# Altium schematic sheet Analog Mux.SchDoc: Analog Mux
size D; DrawnBy: C. Lewis; Engineer: C. Lewis; Address1: 4650 NORRIS CANYON RD.; Address2: SAN RAMON, CA 94583; DocumentNumber: 35133; Revision: D; SheetNumber: 9; SheetTotal: 20; ProjectName: HYDRA
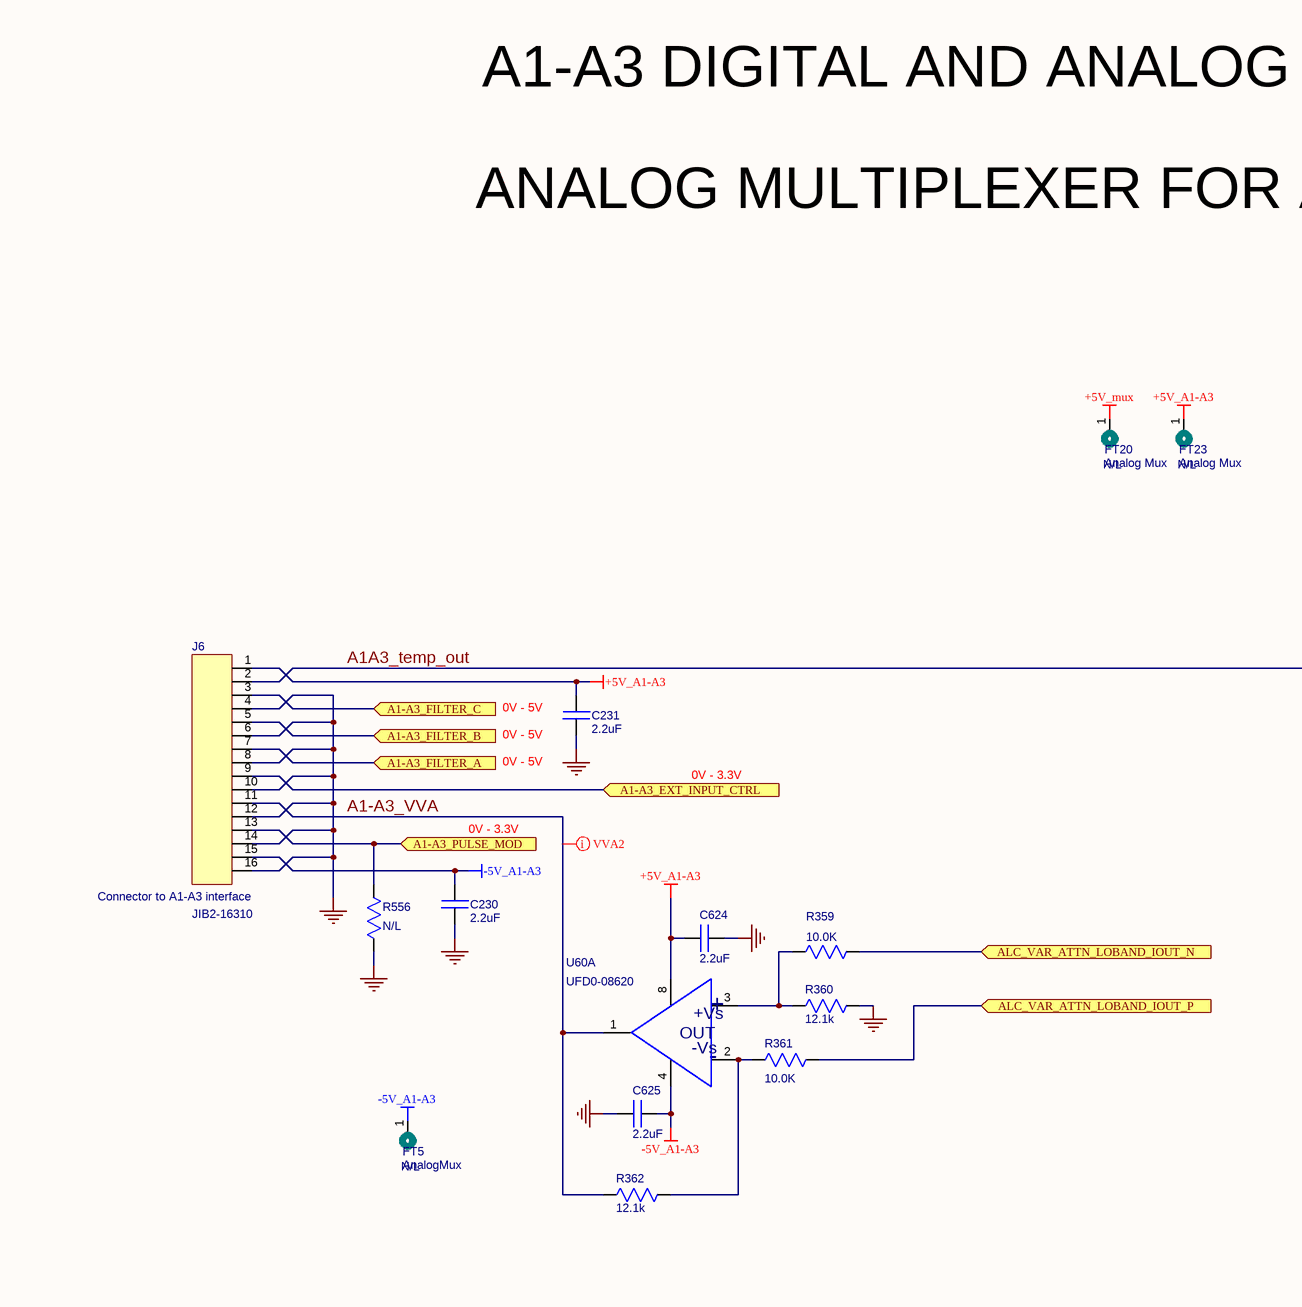
[diagram p0: Analog Mux.SchDoc, top left]
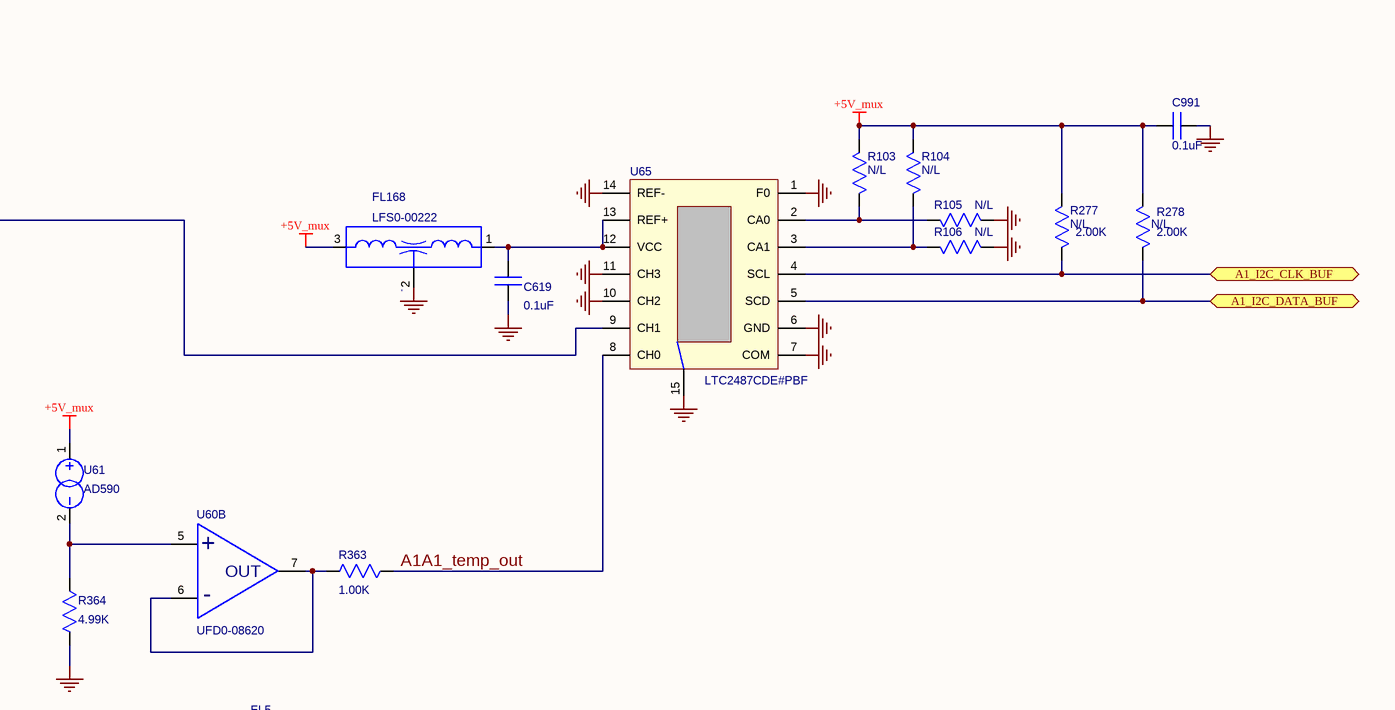
[diagram p1: Analog Mux.SchDoc, top right]
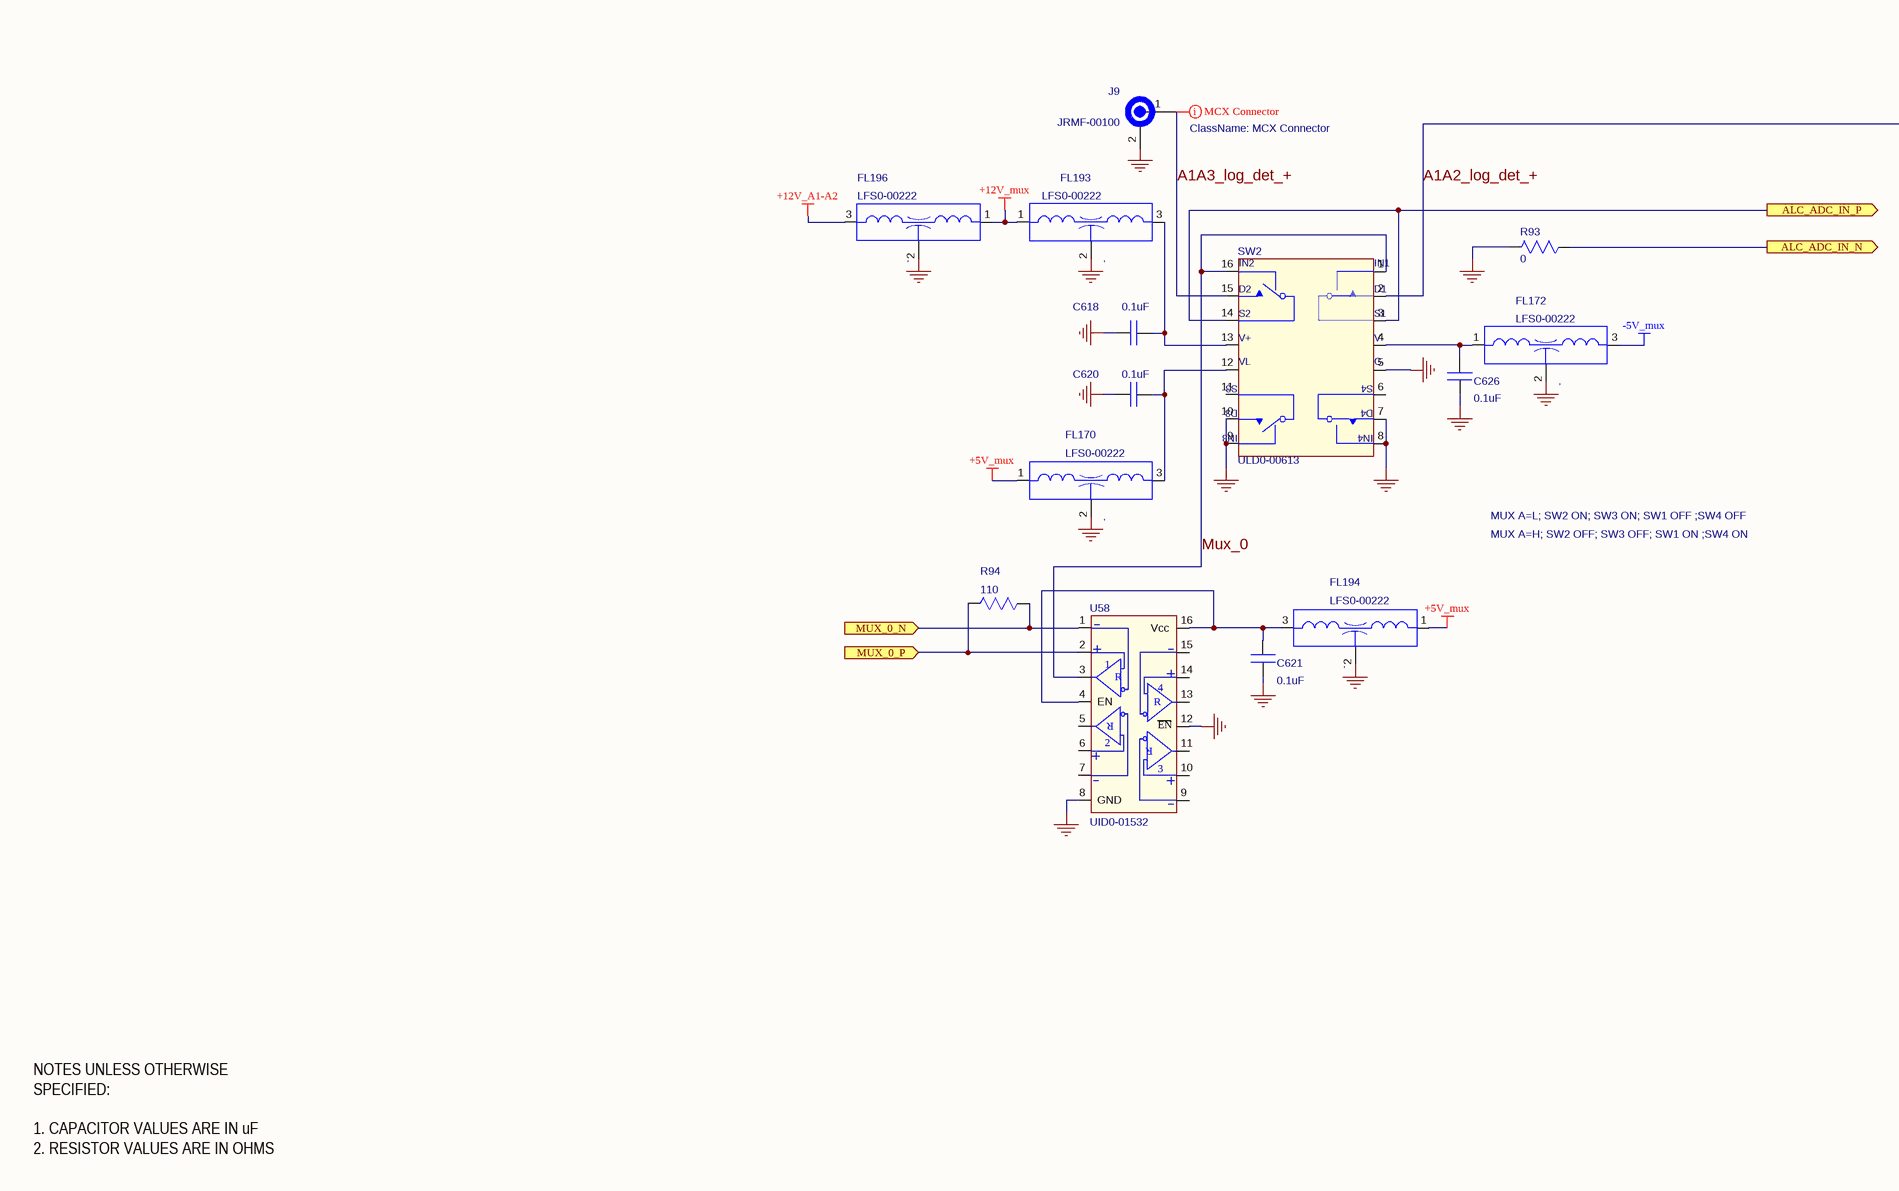
[diagram p2: Analog Mux.SchDoc, bottom left]
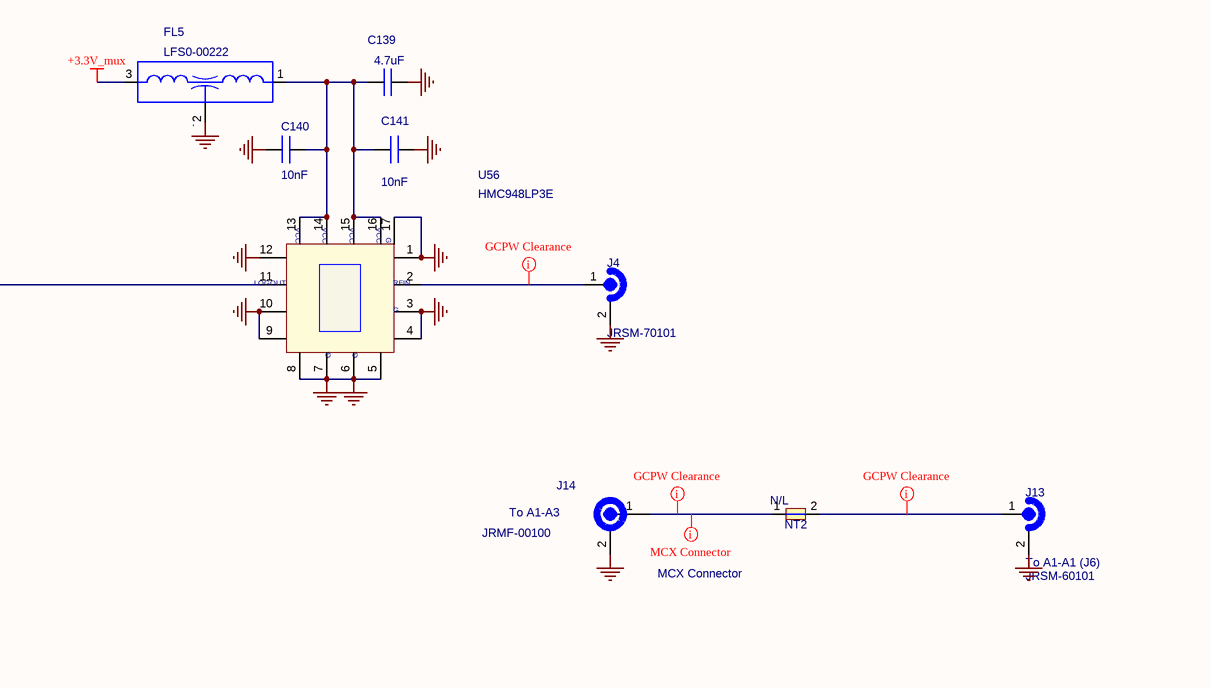
[diagram p3: Analog Mux.SchDoc, bottom right]

## Parts
C139  value 4.7uF  [CAP-0805-N]  (hidden comment: 4.7uF 25V X5R CHIP CERAMIC)
C140  value 10nF  [CAP-0402-N]  (hidden comment: 10nF;10%;X7R;16 WVDC;CHIP;0402)
C141  value 10nF  [CAP-0402-N]  (hidden comment: 10nF;10%;X7R;16 WVDC;CHIP;0402)
C230  value 2.2uF  [CAP-0603-H035-N]  (hidden comment: CAP,CHP,2.2UF,10%,X5R;16V)
C231  value 2.2uF  [CAP-0603-H035-N]  (hidden comment: CAP,CHP,2.2UF,10%,X5R;16V)
C618  value 0.1uF  [CAP-0805-N]  (hidden comment: .1UF;10%;X7R;>25V;CHIP;0805)
C619  value 0.1uF  [CAP-0805-N]  (hidden comment: .1UF;10%;X7R;>25V;CHIP;0805)
C620  value 0.1uF  [CAP-0805-N]  (hidden comment: .1UF;10%;X7R;>25V;CHIP;0805)
C621  value 0.1uF  [CAP-0603-H035-N]  (hidden comment: .1UF;10%;X7R;16V;CHIP;0603)
C624  value 2.2uF  [CAP-0603-H035-N]  (hidden comment: CAP,CHP,2.2UF,10%,X5R;16V)
C625  value 2.2uF  [CAP-0603-H035-N]  (hidden comment: CAP,CHP,2.2UF,10%,X5R;16V)
C626  value 0.1uF  [CAP-0805-N]  (hidden comment: .1UF;10%;X7R;>25V;CHIP;0805)
C991  value 0.1uF  [CAP-0402-N]  (hidden comment: .1 UF,10%;X7R;16V,CHIP;0402)
FL5  Filter EMI 2200PF,1206  [FIL-NFE31P-1206-4P]  (value not drawn)
FL168  Filter EMI 2200PF,1206  [FIL-NFE31P-1206-4P]  (value not drawn)
FL170  Filter EMI 2200PF,1206  [FIL-NFE31P-1206-4P]  (value not drawn)
FL172  Filter EMI 2200PF,1206  [FIL-NFE31P-1206-4P]  (value not drawn)
FL193  Filter EMI 2200PF,1206  [FIL-NFE31P-1206-4P]  (value not drawn)
FL194  Filter EMI 2200PF,1206  [FIL-NFE31P-1206-4P]  (value not drawn)
FL196  Filter EMI 2200PF,1206  [FIL-NFE31P-1206-4P]  (value not drawn)
FT5  AnalogMux  NoLoad: N/L  [FromToNode_ML2]  (net tie, no BOM)
FT20  Analog Mux  NoLoad: N/L  [FromToNode_ML2]  (net tie, no BOM)
FT23  Analog Mux  NoLoad: N/L  [FromToNode_ML2]  (net tie, no BOM)
J4  .  [JRSM-70101]  (value not drawn)
J6  Connector to A1-A3 interface  [JIB2-16310]
J9  A1A3 log det +  [JRMF-00100]  (value not drawn)
J13  To A1-A1 (J6)  [JRSM-60101]
J14  To A1-A3  [JRMF-00100]
NT2  NoLoad: N/L  [NET_TIE_10mil]  (hidden comment: NET TIE, 10 mil line)  (net tie, no BOM)
R93  value 0  [RES-0402-N]  (hidden comment: JUMPER;0 OHMS;SMT;0402)
R94  value 110  [RES-0402-N]  (hidden comment: 110 OHMS; 1%; .1W; 100PPM; FILM; CHIP; 0402)
R103  NoLoad: N/L  [RES-0402-N]  (hidden comment: 2.00K OHMS;.06W;1%;200PPM;FILM;CHIP;0402)
R104  NoLoad: N/L  [RES-0402-N]  (hidden comment: 2.00K OHMS;.06W;1%;200PPM;FILM;CHIP;0402)
R105  NoLoad: N/L  [RES-0402-N]  (hidden comment: JUMPER;0 OHMS;SMT;0402)
R106  NoLoad: N/L  [RES-0402-N]  (hidden comment: JUMPER;0 OHMS;SMT;0402)
R277  value 2.00K  NoLoad: N/L  [RES-0402-N]  (hidden comment: 2.00K OHMS;.06W;1%;200PPM;FILM;CHIP;0402)
R278  value 2.00K  NoLoad: N/L  [RES-0402-N]  (hidden comment: 2.00K OHMS;.06W;1%;200PPM;FILM;CHIP;0402)
R359  value 10.0K  [RES-0402-N]  (hidden comment: 10.0K OHMS;.06W;1%;200PPM;FILM;CHIP;0402)
R360  value 12.1k  [RES-0402-N]  (hidden comment: 12.1K OHMS;.06W;1%;200PPM;FILM;CHIP;0402)
R361  value 10.0K  [RES-0402-N]  (hidden comment: 10.0K OHMS;.06W;1%;200PPM;FILM;CHIP;0402)
R362  value 12.1k  [RES-0402-N]  (hidden comment: 12.1K OHMS;.06W;1%;200PPM;FILM;CHIP;0402)
R363  value 1.00K  [RES-0402-N]  (hidden comment: 1.0K OHMS;.06W;1%;200PPM;FILM;CHIP;0402)
R364  value 4.99K  [RES-0402-N]  (hidden comment: 4.99K OHMS;.06W;1%;200PPM;FILM;CHIP;0402)
R556  NoLoad: N/L  [RES-0402-N]  (hidden comment: 100 OHMS; 1%; .1W; 100PPM; FILM; CHIP; 0402)
SW2  QUAD SPST ANALOG SW;200NS;45 OHM;SO-16  [SOIC-16_Vishay]  (value not drawn)
U56  M_PN: HMC948LP3E  [QFN-16_HITTITE_LP3]  (hidden comment: LOG DETECTOR;1-23 GHz;54dB DYNAMIC RANGE;3x3 mm SMT)
U58  UID0-01532  [MTC16]
U60  OP-AMP;DUAL:PRECISION;LOW CURRENT;LOW NOISE;WIDE  [SO8_MS-012]  (value not drawn)  (parts A,B of 2)
U61  M_PN: AD590  [TO-52]  (hidden comment: IC; 2-Terminal; Temperature Transducer)
U65  M_PN: LTC2487CDE#PBF  [DFN14-LINEAR]  (hidden comment: ADC;16-BIT;2/4 CHANNEL;12SPS;INT REF;5V SUP;QFN14)

## Ports
A1-A3_EXT_INPUT_CTRL, A1-A3_FILTER_A, A1-A3_FILTER_B, A1-A3_FILTER_C, A1-A3_PULSE_MOD, A1_I2C_CLK_BUF, A1_I2C_DATA_BUF, ALC_ADC_IN_N, ALC_ADC_IN_P, ALC_VAR_ATTN_LOBAND_IOUT_N, ALC_VAR_ATTN_LOBAND_IOUT_P, MUX_0_N, MUX_0_P

## Nets
+3.3V_mux: FL5.3(OUT)
+5V_A1-A3: C231.1 C624.1 FT23.1 J6.1 U60.8(V+)
+5V_mux: C991.2 FL168.3(OUT) FL170.1(IN) FL194.1(IN) FT20.1 R103.2 R104.2 R277.2 R278.2 U61.1(+)
+12V_A1-A2: FL196.3(OUT)
+12V_mux: FL193.1(IN) FL196.1(IN)
-5V_A1-A3: C230.1 C625.1 FT5.1 J6.15 U60.4(V-)
-5V_mux: FL172.3(OUT)
GND: C139.1 C140.1 C141.1 C230.2 C231.2 C618.1 C619.1 C620.1 C621.2 C624.2 C625.2 C626.1 C991.1 FL5.2(GND) FL168.2(GND) FL170.2(GND) FL172.2(GND) FL193.2(GND) FL194.2(GND) FL196.2(GND) J4.2(GND) J6.4 J6.6 J6.8 J6.10 J6.12 J6.14 J6.16 J9.2(GND) J13.2(GND) J14.2(GND) R93.1 R105.2 R106.2 R360.2 R364.1 R556.2 SW2.5(G) SW2.7(D4) SW2.8(IN4) SW2.9(IN3) SW2.10(D3) U56.1(NC) U56.3(G) U56.4(NC) U56.5(NC) U56.6(G) U56.7(G) U56.8(NC) U56.9(NC) U56.10(NC) U56.12(NC) U56.17(GND) U58.8(GND) U58.12(EN_Rev) U65.1(F0) U65.6(GND) U65.7(COM) U65.10(CH2) U65.11(CH3) U65.14(REF-) U65.15(PADDLE)
A1-A3_EXT_INPUT_CTRL: J6.9 ; port A1-A3_EXT_INPUT_CTRL
A1-A3_FILTER_A: J6.7 ; port A1-A3_FILTER_A
A1-A3_FILTER_B: J6.5 ; port A1-A3_FILTER_B
A1-A3_FILTER_C: J6.3 ; port A1-A3_FILTER_C
A1-A3_PULSE_MOD: J6.13 R556.1 ; port A1-A3_PULSE_MOD
A1-A3_VVA: J6.11 R362.1 U60.1(OUT)
A1_I2C_CLK_BUF: R277.1 U65.4(SCL) ; port A1_I2C_CLK_BUF
A1_I2C_DATA_BUF: R278.1 U65.5(SCD) ; port A1_I2C_DATA_BUF
A1A1_temp_out: R363.2 U65.8(CH0)
A1A2_log_det_+: SW2.2(D1) U56.11(LOGOUT)
A1A3_log_det_+: J9.1 SW2.15(D2)
A1A3_temp_out: J6.2 U65.9(CH1)
ALC_ADC_IN_N: R93.2 ; port ALC_ADC_IN_N
ALC_ADC_IN_P: SW2.3(S1) SW2.14(S2) ; port ALC_ADC_IN_P
ALC_VAR_ATTN_LOBAND_IOUT_N: R359.2 ; port ALC_VAR_ATTN_LOBAND_IOUT_N
ALC_VAR_ATTN_LOBAND_IOUT_P: R361.2 ; port ALC_VAR_ATTN_LOBAND_IOUT_P
Mux_0: SW2.1(IN1) SW2.16(IN2) U58.3(Rout1)
MUX_0_N: R94.2 U58.1(Rin1-) ; port MUX_0_N
MUX_0_P: R94.1 U58.2(Rin1+) ; port MUX_0_P
NetC139_2: C139.2 C140.2 C141.2 FL5.1(IN) U56.13(VCC) U56.14(VCC) U56.15(NC) U56.16(VCC)
NetC618_2: C618.2 FL193.3(OUT) SW2.13(V+)
NetC619_2: C619.2 FL168.1(IN) U65.12(VCC) U65.13(REF+)
NetC620_2: C620.2 FL170.3(OUT) SW2.12(VL)
NetC621_1: C621.1 FL194.3(OUT) U58.4(EN) U58.16(Vcc)
NetC626_2: C626.2 FL172.1(IN) SW2.4(V-)
NetJ4_1: J4.1(CNTR) U56.2(RFIN)
NetJ13_1: J13.1(CNTR) NT2.2
NetJ14_1: J14.1 NT2.1
NetR103_1: R103.1 R105.1 U65.2(CA0)
NetR104_1: R104.1 R106.1 U65.3(CA1)
NetR359_1: R359.1 R360.1 U60.3(+IN)
NetR361_1: R361.1 R362.2 U60.2(-IN)
NetR363_1: R363.1 U60.6(-IN) U60.7(OUT)
NetR364_2: R364.2 U60.5(+IN) U61.2(-)

Not connected (* = marked no-connect by the designer): SW2 6(S4) 11(S3); U58 5(Rout2) 6(Rin2+) 7(Rin2-) 9(Rin3-) 10(Rin3+) 11(Rout3) 13(Rout4) 14(Rin4+) 15(Rin4-)

## Layout directives
net class GCPW Clearance: NetJ4_1, NetJ13_1, NetJ14_1
net class MCX Connector: A1A3_log_det_+, NetJ14_1
net class VVA2: A1-A3_VVA

## Notes on the sheet
- A1-A3 DIGITAL AND ANALOG INTERFACE
- ANALOG MULTIPLEXER FOR A1-A2 AND A1-A3 LOG DETECTOR OUTPUTS
- (near C231) 0V - 5V
- 0V - 3.3V
- MUX A=L; SW2 ON; SW3 ON; SW1 OFF ;SW4 OFF
- MUX A=H; SW2 OFF; SW3 OFF; SW1 ON ;SW4 ON
- NOTES UNLESS OTHERWISE SPECIFIED:
  1. CAPACITOR VALUES ARE IN uF
  2. RESISTOR VALUES ARE IN OHMS
- Title
- Sheet Title
- PRINTED DOCUMENT IS CONSIDERED UNCONTROLLED. VERIFY REVISION IN PLM SYSTEM.
- THIS DOCUMENT CONTAINS PROPRIETARY INFORMATION. DESIGN RIGHTS BELONG TO GIGA-TRONICS AND MAY NOT BE REPRODUCED WITHOUT WRITTEN AUTHORIZATION FOR ANY REASON EXCEPT CALIBRATION, OPERATION AND MAINTENANCE.
- Size
- CAGE CODE
- Filename
- D
- Document Number
- 58900
- Date
- Sheet
- Rev
- of
- (in symbol LFS0-00222) ,
- (in symbol UFD0-08620, part A) +; +Vs; -Vs; -
- (in symbol UFD0-08620, part B) +; -
- (in symbol UID0-01532) R

## Library data of the parts
C139 = CK50-15470: Approved: CL; NoLoad: .; MFGR: ANY; level: 1; line_number: 280; ModifyDate: 02/26/203; M_PN: ANY; G_PN: CK50-15470; item_number: CK50-15470
C140 C141 = TCC3-03100: Approved: CL; MFGR: ATC; M_PN: ATC520L103KT16T; NoLoad: .; level: 1; line_number: 90; ModifyDate: 4/26/13; G_PN: TCC3-03100; item_number: TCC3-03100
C230 C231 C624 C625 = CK45-05220: Approved: CL; NoLoad: .; MFGR: ANY; level: 1; line_number: 113; ModifyDate: 4/30/15; G_PN: CK45-05220; M_PN: ANY; item_number: CK45-05220
C618-C620 C626 = CK50-04100: Approved: CL; NoLoad: .; MFGR: ANY; level: 1; line_number: 250; G_PN: CK50-04100; ModifyDate: 02/22/12; M_PN: ANY; item_number: CK50-04100
C621 = CK45-04100: Approved: CL; NoLoad: .; MFGR: ANY; level: 1; line_number: 105; ModifyDate: 02/22/12; G_PN: CK45-04100; M_PN: ANY; item_number: CK45-04100
C991 = CK40-04100: Approved: CL; NoLoad: .; MFGR: VENKEL; M_PN: C0402X7R160-104KNP; level: 1; line_number: 95; G_PN: CK40-04100; ModifyDate: 3/29/13; item_number: CK40-04100
FL5 FL168 FL170 FL172 FL193 FL194 FL196 = LFS0-00222: Approved: CL; NoLoad: .; M_PN: NFE31PT222Z1E9BL; MFGR: MURATA; level: 1; line_number: 335; G_PN: LFS0-00222; ModifyDate: 02/22/12; Value: 2200pF; item_number: LFS0-00222
FT5 FT20 FT23 = FromToNode: level: 1; Approved: *; G_PN: *; MFGR: *; Value: *
J4 = JRSM-70101: SMPM FD MALE,STRAIGHT SMT, R/A COPLANAR, 4 PIN THRU-HOLE; Value: B012-P93-02; MFGR: GILBERT; Approved: CL; level: 1; line_number: 480; M_PN: B012-P93-02; NoLoad: .; ModifyDate: 10/15/14; G_PN: JRSM-70101; item_number: JRSM-70101
J6 = JIB2-16310: STRIPLINE SOCKET;2MM CTR;2X8 PIN;.31" HT; M_PN: ESQT-108-03-G-D-310; Approved: NM; NoLoad: .; MFGR: SAMTEC; level: 1; line_number: 500; ModifyDate: 12/05/12; G_PN: JIB2-16310; item_number: JIB2-16310
J9 J14 = JRMF-00100: MCX F;PC MOUNT;STRAIGHT;.1 LEADSP; M_PN: R-113-427-000; MFGR: RADIAL; Approved: NM; NoLoad: .; level: 1; line_number: 510; ModifyDate: 12/30/12; G_PN: JRMF-00100; item_number: JRMF-00100
J13 = JRSM-60101: SMPM SM MALE,STRAIGHT SMT, R/A COPLANAR, 4 PIN THRU-HOLE; Value: B012-P95-02; MFGR: GILBERT; Approved: CL; NoLoad: .; level: 1; line_number: 483; M_PN: B012-P95-02; ModifyDate: 1/6/14; G_PN: JRSM-60101; item_number: JRSM-60101
NT2 = NET_TIE_10mil: Approved: CL; level: 1
R93 = RK35-00000: Approved: CL; NoLoad: .; MFGR: ANY; level: 1; line_number: 1005; G_PN: RK35-00000; ModifyDate: 02/22/12; M_PN: ANY; item_number: RK35-00000
R94 = RK35-01100: Approved: CL; NoLoad: .; MFGR: ANY; level: 1; line_number: 1055; ModifyDate: 02/22/12; G_PN: RK35-01100; M_PN: ANY; item_number: RK35-01100
R103 R104 R277 R278 = RK35-12000: MFGR: ANY; Approved: CL; level: 1; line_number: 660; G_PN: RK35-12000; ModifyDate: 02/22/12; M_PN: ANY; item_number: RK35-12000
  R103 R104: Value: 2.00K
R105 R106 = RK35-00000: MFGR: ANY; Approved: CL; Value: 0; level: 1; line_number: 1005; G_PN: RK35-00000; ModifyDate: 02/22/12; M_PN: ANY; item_number: RK35-00000
R359 R361 = RK35-21000: Approved: CL; NoLoad: .; MFGR: ANY; level: 1; line_number: 700; G_PN: RK35-21000; ModifyDate: 02/22/12; M_PN: ANY; item_number: RK35-21000
R360 R362 = RK35-21210: Approved: CL; NoLoad: .; MFGR: ANY; level: 1; line_number: 852; G_PN: RK35-21210; ModifyDate: 4/26/13; M_PN: ANY; item_number: RK35-21210
R363 = RK35-11000: Approved: CL; NoLoad: .; MFGR: ANY; level: 1; line_number: 1025; G_PN: RK35-11000; ModifyDate: 02/22/12; M_PN: ANY; item_number: RK35-11000
R364 = RK35-14990: Approved: CL; NoLoad: .; MFGR: ANY; level: 1; line_number: 720; G_PN: RK35-14990; ModifyDate: 4/11/12; M_PN: ANY; item_number: RK35-14990
R556 = RK35-01000: Approved: CL; MFGR: ANY; Value: 100; level: 1; line_number: 960; G_PN: RK35-01000; ModifyDate: 02/22/12; M_PN: ANY; item_number: RK35-01000
SW2 = ULD0-00613: Value: DG613DY; MFGR: VISHAY; NoLoad: .; Approved: NM; level: 1; line_number: 1060; ModifyDate: 2/20/13; M_PN: DG613DY; G_PN: ULD0-00613; item_number: ULD0-00613
U56 = MD00-00123: MFGR: HITTITE; Approved: CL; Value: HMC948LP3E; NoLoad: .; level: 1; line_number: 1255; ModifyDate: 4/26/13; G_PN: MD00-00123; item_number: MD00-00123
U58 = UID0-01532: FIN1532 5V LVDS 4-Bit High Speed Differential Receiver;16-Lead TSSOP Package; MFGR: Fairchild Semiconductor; NoLoad: .; Approved: XiaoXiao; level: 1; line_number: 1215; ModifyDate: 07/31/2012; M_PN: FIN1532; G_PN: UID0-01532; item_number: UID0-01532
U60 = UFD0-08620: Value: AD8620; NoLoad: .; Approved: CL; MFGR: ANALOG DEVICES; level: 1; line_number: 1200; ModifyDate: 02/20/13; M_PN: AD8620; G_PN: UFD0-08620; item_number: UFD0-08620
U61 = 18729: NoLoad: .; Approved: NM; MFGR: ANALOG DEVICES; level: 1; line_number: 1260; G_PN: 18729; ModifyDate: 12/06/12; item_number: 18729
U65 = UID0-02487: Value: LTC2487CDE#PBF; NoLoad: .; Approved: CL; MFGR: LINEAR TECHNOLOGY; level: 1; line_number: 1265; ModifyDate: 3/27/13; G_PN: UID0-02487; item_number: UID0-02487